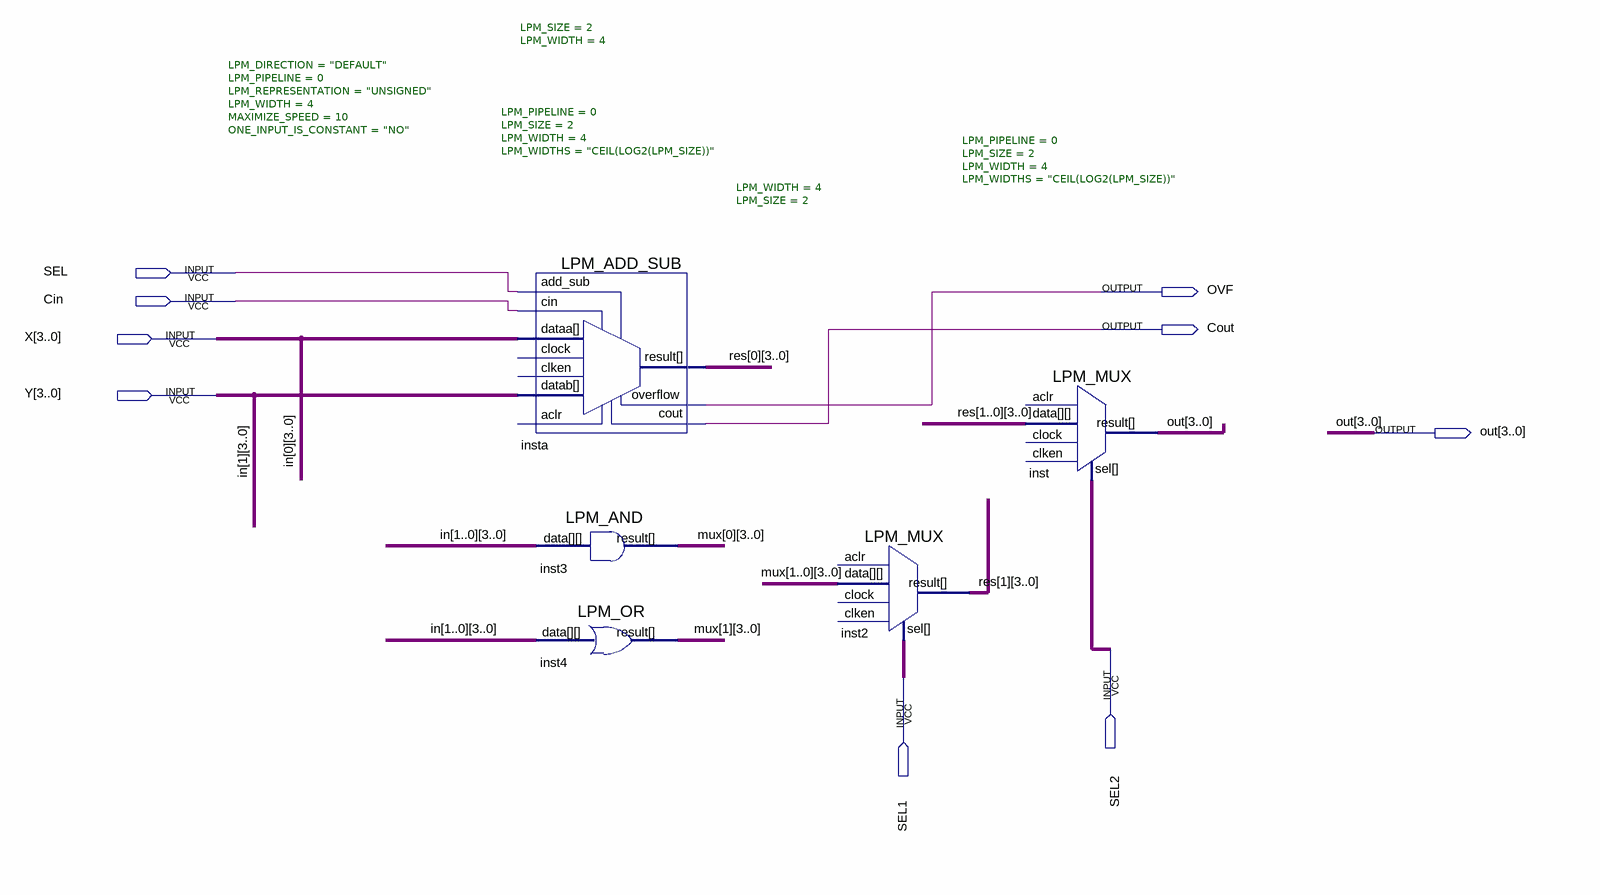
[diagram p0: schematic sheet]
// Quartus schematic CO.bdf as structural Verilog: 5 symbols, 9 pins
module CO (
  input  SEL,
  input  Cin,
  input  [3:0] X,
  input  [3:0] Y,
  input  SEL2,
  input  SEL1,
  output OVF,
  output Cout,
  output [3:0] out
);

  wire [3:0] mux_0, mux_1, res_0, res_1;

  LPM_ADD_SUB #(.LPM_DIRECTION("DEFAULT"), .LPM_PIPELINE(0), .LPM_REPRESENTATION("UNSIGNED"), .LPM_WIDTH(4), .MAXIMIZE_SPEED(10), .ONE_INPUT_IS_CONSTANT("NO")) insta (
    .datab(Y), .add_sub(SEL), .dataa(X), .cin(Cin), .cout(Cout), .overflow(OVF), .result(res_0));  // open: aclr, clock, clken
  LPM_AND #(.LPM_SIZE(2), .LPM_WIDTH(4)) inst3 (.data({Y, X}), .result(mux_0));
  LPM_OR #(.LPM_WIDTH(4), .LPM_SIZE(2)) inst4 (.data({Y, X}), .result(mux_1));
  LPM_MUX #(.LPM_PIPELINE(0), .LPM_SIZE(2), .LPM_WIDTH(4), .LPM_WIDTHS("CEIL(LOG2(LPM_SIZE))")) inst2 (
    .data({mux_1, mux_0}), .sel(SEL1), .result(res_1));  // open: clock, aclr, clken
  LPM_MUX #(.LPM_PIPELINE(0), .LPM_SIZE(2), .LPM_WIDTH(4), .LPM_WIDTHS("CEIL(LOG2(LPM_SIZE))")) inst (
    .data({res_1, res_0}), .sel(SEL2), .result(out));  // open: clock, aclr, clken

  // Other names for the same wires on the sheet: in_0[3:0] = X; in_1[3:0] = Y
endmodule
